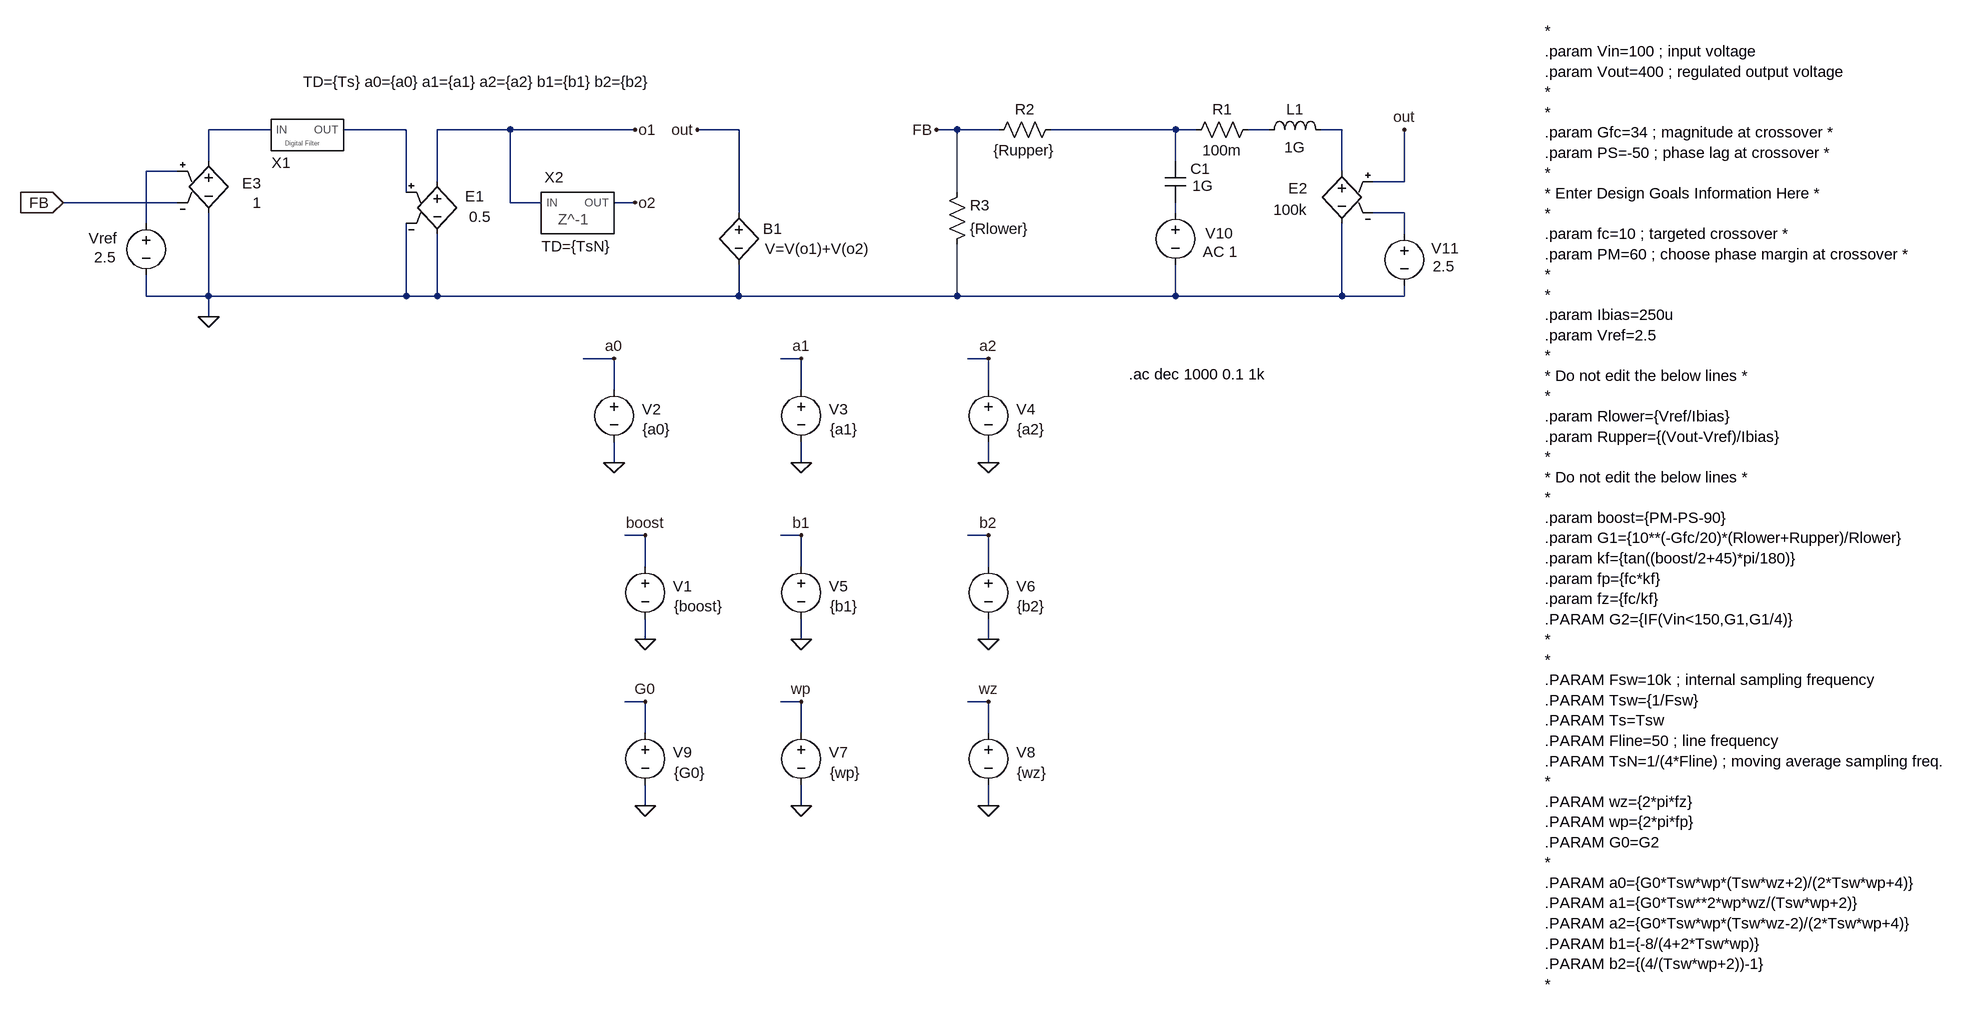
[diagram p0: schematic Type 2 digital notch -delay lines.asc]
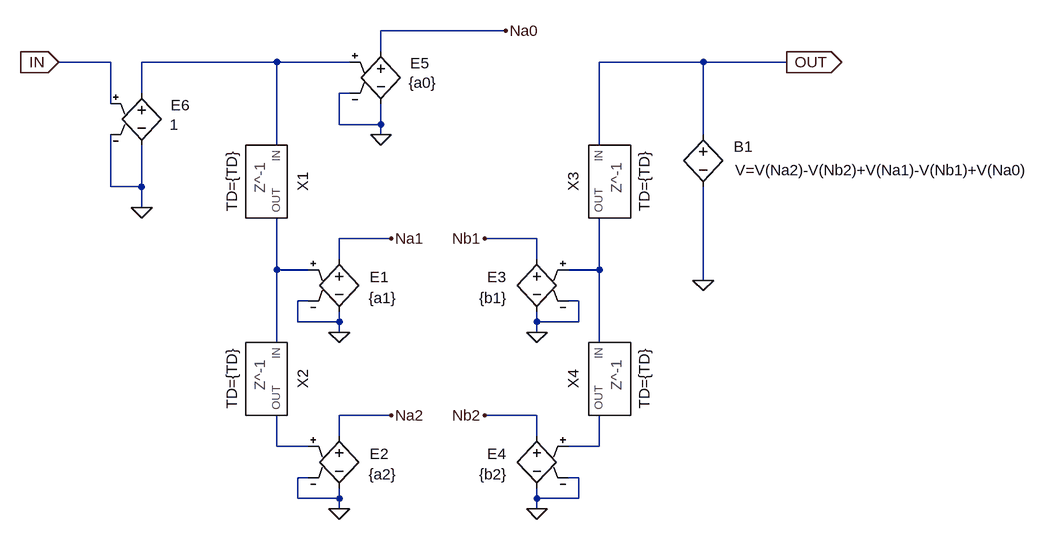
[diagram p1: sub-circuit type_2_digital.asc]
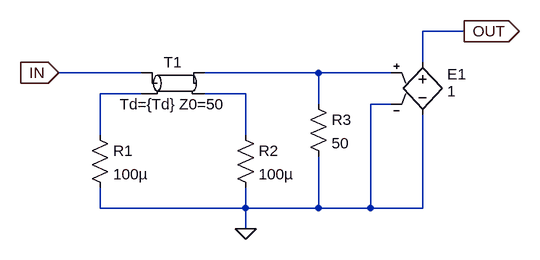
[diagram p2: sub-circuit zminus1.asc]
Type 2 digital notch -delay lines.asc, the LTspice schematic file:
Version 4
SHEET 1 1944 1524
WIRE -848 48 -944 48
WIRE -640 48 -736 48
WIRE -480 48 -592 48
WIRE -288 48 -480 48
WIRE -128 48 -192 48
WIRE 208 48 176 48
WIRE 272 48 208 48
WIRE 544 48 352 48
WIRE 576 48 544 48
WIRE 688 48 656 48
WIRE 800 48 768 48
WIRE -944 96 -944 48
WIRE 544 96 544 48
WIRE -992 112 -1040 112
WIRE 800 112 800 48
WIRE -592 128 -592 48
WIRE 896 128 896 48
WIRE 896 128 848 128
WIRE -640 144 -640 48
WIRE 208 144 208 48
WIRE -992 160 -1168 160
WIRE -480 160 -480 48
WIRE -432 160 -480 160
WIRE -288 160 -320 160
WIRE -128 176 -128 48
WIRE 544 176 544 160
WIRE 896 176 848 176
WIRE -1040 192 -1040 112
WIRE 896 208 896 176
WIRE -1040 304 -1040 272
WIRE -944 304 -944 176
WIRE -944 304 -1040 304
WIRE -640 304 -640 192
WIRE -640 304 -944 304
WIRE -592 304 -592 208
WIRE -592 304 -640 304
WIRE -128 304 -128 256
WIRE -128 304 -592 304
WIRE 208 304 208 224
WIRE 208 304 -128 304
WIRE 544 304 544 256
WIRE 544 304 208 304
WIRE 800 304 800 192
WIRE 800 304 544 304
WIRE 896 304 896 288
WIRE 896 304 800 304
WIRE -944 336 -944 304
WIRE -320 400 -368 400
WIRE -32 400 -64 400
WIRE 256 400 224 400
WIRE -320 448 -320 400
WIRE -32 448 -32 400
WIRE 256 448 256 400
WIRE -320 560 -320 528
WIRE -32 560 -32 528
WIRE 256 560 256 528
WIRE -272 672 -304 672
WIRE -32 672 -64 672
WIRE 256 672 224 672
WIRE -272 720 -272 672
WIRE -32 720 -32 672
WIRE 256 720 256 672
WIRE -272 832 -272 800
WIRE -32 832 -32 800
WIRE 256 832 256 800
WIRE -272 928 -304 928
WIRE -32 928 -64 928
WIRE 256 928 224 928
WIRE -272 976 -272 928
WIRE -32 976 -32 928
WIRE 256 976 256 928
WIRE -272 1088 -272 1056
WIRE -32 1088 -32 1056
WIRE 256 1088 256 1056
FLAG -944 336 0
FLAG -320 560 0
FLAG -32 560 0
FLAG -320 400 a0
FLAG -32 400 a1
FLAG 256 560 0
FLAG -32 832 0
FLAG 256 400 a2
FLAG -32 672 b1
FLAG 256 832 0
FLAG 256 672 b2
FLAG -32 1088 0
FLAG -32 928 wp
FLAG 256 1088 0
FLAG 256 928 wz
FLAG -272 1088 0
FLAG -272 928 G0
FLAG 896 48 out
FLAG 176 48 FB
FLAG -1168 160 FB
IOPIN -1168 160 In
FLAG -288 48 o1
FLAG -288 160 o2
FLAG -192 48 out
FLAG -272 832 0
FLAG -272 672 boost
DATAFLAG -368 400 ""
DATAFLAG -64 400 ""
DATAFLAG 224 400 ""
DATAFLAG -64 672 ""
DATAFLAG 224 672 ""
DATAFLAG -64 928 ""
DATAFLAG 224 928 ""
DATAFLAG -304 928 ""
DATAFLAG 464 48 ""
DATAFLAG -128 48 ""
DATAFLAG -304 672 ""
SYMBOL Type_2_digital -800 48 R0
WINDOW 39 275 -58 Bottom 2
WINDOW 0 -32 66 Bottom 2
SYMATTR SpiceLine TD={Ts} a0={a0} a1={a1} a2={a2} b1={b1} b2={b2}
SYMATTR InstName X1
SYMBOL voltage -320 432 R0
WINDOW 0 43 46 Left 2
WINDOW 3 44 77 Left 2
SYMATTR InstName V2
SYMATTR Value {a0}
SYMBOL voltage -32 432 R0
WINDOW 0 43 46 Left 2
WINDOW 3 44 77 Left 2
SYMATTR InstName V3
SYMATTR Value {a1}
SYMBOL voltage 256 432 R0
WINDOW 0 43 46 Left 2
WINDOW 3 44 77 Left 2
SYMATTR InstName V4
SYMATTR Value {a2}
SYMBOL voltage -32 704 R0
WINDOW 0 43 46 Left 2
WINDOW 3 44 77 Left 2
SYMATTR InstName V5
SYMATTR Value {b1}
SYMBOL voltage 256 704 R0
WINDOW 0 43 46 Left 2
WINDOW 3 44 77 Left 2
SYMATTR InstName V6
SYMATTR Value {b2}
SYMBOL voltage -32 960 R0
WINDOW 0 43 46 Left 2
WINDOW 3 44 77 Left 2
SYMATTR InstName V7
SYMATTR Value {wp}
SYMBOL voltage 256 960 R0
WINDOW 0 43 46 Left 2
WINDOW 3 44 77 Left 2
SYMATTR InstName V8
SYMATTR Value {wz}
SYMBOL voltage -272 960 R0
WINDOW 0 43 46 Left 2
WINDOW 3 44 77 Left 2
SYMATTR InstName V9
SYMATTR Value {G0}
SYMBOL e 800 96 M0
WINDOW 0 53 42 Left 2
WINDOW 3 53 75 Left 2
SYMATTR InstName E2
SYMATTR Value 100k
SYMBOL ind 672 64 R270
WINDOW 0 32 56 VTop 2
WINDOW 3 5 56 VBottom 2
SYMATTR InstName L1
SYMATTR Value 1G
SYMBOL res 672 32 R90
WINDOW 0 0 56 VBottom 2
WINDOW 3 32 56 VTop 2
SYMATTR InstName R1
SYMATTR Value 100m
SYMBOL cap 528 96 R0
WINDOW 0 39 12 Left 2
WINDOW 3 42 38 Left 2
SYMATTR InstName C1
SYMATTR Value 1G
SYMBOL voltage 544 160 R0
WINDOW 0 46 47 Left 2
WINDOW 123 42 76 Left 2
WINDOW 39 0 0 Left 0
SYMATTR InstName V10
SYMATTR Value2 AC 1
SYMATTR Value ""
SYMBOL voltage 896 192 R0
WINDOW 0 42 38 Left 2
WINDOW 3 44 66 Left 2
SYMATTR InstName V11
SYMATTR Value 2.5
SYMBOL res 368 32 R90
WINDOW 0 0 56 VBottom 2
WINDOW 3 32 56 VTop 2
SYMATTR InstName R2
SYMATTR Value {Rupper}
SYMBOL res 192 240 M180
WINDOW 0 36 76 Left 2
WINDOW 3 36 40 Left 2
SYMATTR InstName R3
SYMATTR Value {Rlower}
SYMBOL voltage -1040 176 M0
WINDOW 0 44 39 Left 2
WINDOW 3 46 68 Left 2
SYMATTR InstName Vref
SYMATTR Value 2.5
SYMBOL e -944 80 R0
WINDOW 0 52 50 Left 2
WINDOW 3 68 80 Left 2
SYMATTR InstName E3
SYMATTR Value 1
SYMBOL Zminus1 -384 160 R0
WINDOW 0 -28 -23 Bottom 2
WINDOW 39 6 83 Bottom 2
SYMATTR InstName X2
SYMATTR SpiceLine TD={TsN}
SYMBOL e -592 112 R0
WINDOW 0 43 38 Left 2
WINDOW 3 49 70 Left 2
SYMATTR InstName E1
SYMATTR Value 0.5
SYMBOL bv -128 160 R0
WINDOW 0 37 40 Left 2
WINDOW 3 40 71 Left 2
SYMATTR InstName B1
SYMATTR Value V=V(o1)+V(o2)
SYMBOL voltage -272 704 R0
WINDOW 0 43 46 Left 2
WINDOW 3 44 77 Left 2
SYMATTR InstName V1
SYMATTR Value {boost}
TEXT 1112 -104 Left 2 !*\n.param Vin=100 ; input voltage\n.param Vout=400 ; regulated output voltage\n*\n*\n.param Gfc=34 ; magnitude at crossover *\n.param PS=-50 ; phase lag at crossover *\n*\n* Enter Design Goals Information Here *\n*\n.param fc=10 ; targeted crossover *\n.param PM=60 ; choose phase margin at crossover *\n*\n*\n.param Ibias=250u\n.param Vref=2.5\n*\n* Do not edit the below lines *\n*\n.param Rlower={Vref/Ibias}\n.param Rupper={(Vout-Vref)/Ibias}\n*\n* Do not edit the below lines *\n*\n.param boost={PM-PS-90}\n.param G1={10**(-Gfc/20)*(Rlower+Rupper)/Rlower}\n.param kf={tan((boost/2+45)*pi/180)}\n.param fp={fc*kf}\n.param fz={fc/kf}\n.PARAM G2={IF(Vin<150,G1,G1/4)}\n*\n*\n.PARAM Fsw=10k ; internal sampling frequency\n.PARAM Tsw={1/Fsw}\n.PARAM Ts=Tsw\n.PARAM Fline=50 ; line frequency\n.PARAM TsN=1/(4*Fline) ; moving average sampling freq.\n*\n.PARAM wz={2*pi*fz}\n.PARAM wp={2*pi*fp}\n.PARAM G0=G2\n*\n.PARAM a0={G0*Tsw*wp*(Tsw*wz+2)/(2*Tsw*wp+4)}\n.PARAM a1={G0*Tsw**2*wp*wz/(Tsw*wp+2)}\n.PARAM a2={G0*Tsw*wp*(Tsw*wz-2)/(2*Tsw*wp+4)}\n.PARAM b1={-8/(4+2*Tsw*wp)}\n.PARAM b2={(4/(Tsw*wp+2))-1}\n*
TEXT 472 424 Left 2 !.ac dec 1000 0.1 1k

type_2_digital.asc, the sub-circuit schematic file:
Version 4
SHEET 1 1788 680
WIRE 544 -368 352 -368
WIRE 352 -336 352 -368
WIRE -64 -320 -144 -320
WIRE 192 -320 -16 -320
WIRE 304 -320 192 -320
WIRE 848 -320 688 -320
WIRE 976 -320 848 -320
WIRE -16 -272 -16 -320
WIRE 304 -272 288 -272
WIRE -64 -256 -64 -320
WIRE 288 -224 288 -272
WIRE 352 -224 352 -256
WIRE 352 -224 288 -224
WIRE 352 -208 352 -224
WIRE 848 -208 848 -320
WIRE 192 -192 192 -320
WIRE 688 -192 688 -320
WIRE -64 -128 -64 -208
WIRE -16 -128 -16 -192
WIRE -16 -128 -64 -128
WIRE -16 -96 -16 -128
WIRE 368 -48 288 -48
WIRE 592 -48 512 -48
WIRE 288 -16 288 -48
WIRE 592 -16 592 -48
WIRE 192 0 192 -80
WIRE 240 0 192 0
WIRE 688 0 688 -80
WIRE 688 0 640 0
WIRE 848 16 848 -128
WIRE 240 48 224 48
WIRE 656 48 640 48
WIRE 224 80 224 48
WIRE 288 80 288 64
WIRE 288 80 224 80
WIRE 592 80 592 64
WIRE 656 80 656 48
WIRE 656 80 592 80
WIRE 288 96 288 80
WIRE 592 96 592 80
WIRE 192 112 192 0
WIRE 688 112 688 0
WIRE 368 224 288 224
WIRE 592 224 512 224
WIRE 288 256 288 224
WIRE 592 256 592 224
WIRE 192 272 192 224
WIRE 240 272 192 272
WIRE 688 272 688 224
WIRE 688 272 640 272
WIRE 240 320 224 320
WIRE 656 320 640 320
WIRE 224 352 224 320
WIRE 288 352 288 336
WIRE 288 352 224 352
WIRE 592 352 592 336
WIRE 656 352 656 320
WIRE 656 352 592 352
WIRE 288 368 288 352
WIRE 592 368 592 352
FLAG 288 96 0
FLAG 288 368 0
FLAG 368 -48 Na1
FLAG 368 224 Na2
FLAG 592 96 0
FLAG 592 368 0
FLAG 512 -48 Nb1
FLAG 512 224 Nb2
FLAG 352 -208 0
FLAG 544 -368 Na0
FLAG 848 16 0
FLAG 976 -320 OUT
IOPIN 976 -320 Out
FLAG -144 -320 IN
IOPIN -144 -320 In
FLAG -16 -96 0
SYMBOL Zminus1 192 -144 R90
WINDOW 39 7 85 Bottom 2
SYMATTR SpiceLine TD={TD}
SYMATTR InstName X1
SYMBOL Zminus1 192 160 R90
WINDOW 39 7 85 Bottom 2
SYMATTR SpiceLine TD={TD}
SYMATTR InstName X2
SYMBOL e 288 -32 R0
WINDOW 0 47 43 Left 2
WINDOW 3 45 75 Left 2
SYMATTR InstName E1
SYMATTR Value {a1}
SYMBOL e 288 240 R0
WINDOW 0 47 43 Left 2
WINDOW 3 45 75 Left 2
SYMATTR InstName E2
SYMATTR Value {a2}
SYMBOL Zminus1 688 -144 M90
WINDOW 39 7 85 Bottom 2
SYMATTR SpiceLine TD={TD}
SYMATTR InstName X3
SYMBOL Zminus1 688 160 M90
WINDOW 39 7 85 Bottom 2
SYMATTR SpiceLine TD={TD}
SYMATTR InstName X4
SYMBOL e 592 -32 M0
WINDOW 0 47 43 Left 2
WINDOW 3 45 75 Left 2
SYMATTR InstName E3
SYMATTR Value {b1}
SYMBOL e 592 240 M0
WINDOW 0 47 43 Left 2
WINDOW 3 45 75 Left 2
SYMATTR InstName E4
SYMATTR Value {b2}
SYMBOL e 352 -352 R0
WINDOW 0 45 34 Left 2
WINDOW 3 43 64 Left 2
SYMATTR InstName E5
SYMATTR Value {a0}
SYMBOL bv 848 -224 R0
WINDOW 0 47 34 Left 2
WINDOW 3 49 70 Left 2
SYMATTR InstName B1
SYMATTR Value V=V(Na2)-V(Nb2)+V(Na1)-V(Nb1)+V(Na0)
SYMBOL e -16 -288 R0
WINDOW 0 45 34 Left 2
WINDOW 3 43 64 Left 2
SYMATTR InstName E6
SYMATTR Value 1

zminus1.asc, the sub-circuit schematic file:
Version 4
SHEET 1 880 680
WIRE 624 80 560 80
WIRE 560 128 560 80
WIRE 128 144 0 144
WIRE 400 144 224 144
WIRE 512 144 400 144
WIRE 128 176 64 176
WIRE 288 176 224 176
WIRE 400 192 400 144
WIRE 512 192 480 192
WIRE 64 240 64 176
WIRE 288 240 288 176
WIRE 64 352 64 320
WIRE 288 352 288 320
WIRE 288 352 64 352
WIRE 400 352 400 272
WIRE 400 352 288 352
WIRE 480 352 480 192
WIRE 480 352 400 352
WIRE 560 352 560 208
WIRE 560 352 480 352
WIRE 288 384 288 352
FLAG 624 80 OUT
IOPIN 624 80 Out
FLAG 0 144 IN
IOPIN 0 144 In
FLAG 288 384 0
SYMBOL tline 176 160 R0
SYMATTR InstName T1
SYMATTR Value Td={Td} Z0=50
SYMBOL res 48 224 R0
SYMATTR InstName R1
SYMATTR Value 100µ
SYMBOL res 272 224 R0
SYMATTR InstName R2
SYMATTR Value 100µ
SYMBOL res 384 176 R0
SYMATTR InstName R3
SYMATTR Value 50
SYMBOL e 560 112 R0
WINDOW 0 38 34 Left 2
WINDOW 3 38 60 Left 2
SYMATTR InstName E1
SYMATTR Value 1

The netlist it stands for:
* Type 2 digital notch -delay lines.asc
XX1 N001 N002 type_2_digital params: TD={Ts} a0={a0} a1={a1} a2={a2} b1={b1} b2={b2}
V2 a0 0 {a0}
V3 a1 0 {a1}
V4 a2 0 {a2}
V5 b1 0 {b1}
V6 b2 0 {b2}
V7 wp 0 {wp}
V8 wz 0 {wz}
V9 G0 0 {G0}
E2 N005 0 out N008 100k
L1 N004 N005 1G
R1 N004 N003 100m
C1 N003 N007 1G
V10 N007 0 AC 1
V11 N008 0 2.5
R2 N003 FB {Rupper}
R3 0 FB {Rlower}
Vref N006 0 2.5
E3 N001 0 N006 FB 1
XX2 o1 o2 zminus1 params: TD={TsN}
E1 o1 0 N002 0 0.5
B1 out 0 V=V(o1)+V(o2)
V1 boost 0 {boost}

* block symbol definitions
.subckt type_2_digital IN OUT
XX1 N001 N002 zminus1 params: TD={TD}
XX2 N002 N004 zminus1 params: TD={TD}
E1 Na1 0 N002 0 {a1}
E2 Na2 0 N004 0 {a2}
XX3 OUT N003 zminus1 params: TD={TD}
XX4 N003 N005 zminus1 params: TD={TD}
E3 Nb1 0 N003 0 {b1}
E4 Nb2 0 N005 0 {b2}
E5 Na0 0 N001 0 {a0}
B1 OUT 0 V=V(Na2)-V(Nb2)+V(Na1)-V(Nb1)+V(Na0)
E6 N001 0 IN 0 1
.ends type_2_digital

.subckt zminus1 IN OUT
T1 IN N002 N001 N003 Td={Td} Z0=50
R1 N002 0 100µ
R2 N003 0 100µ
R3 N001 0 50
E1 OUT 0 N001 0 1
.ends zminus1

*
.param Vin=100 ; input voltage
.param Vout=400 ; regulated output voltage
*
*
.param Gfc=34 ; magnitude at crossover *
.param PS=-50 ; phase lag at crossover *
*
* Enter Design Goals Information Here *
*
.param fc=10 ; targeted crossover *
.param PM=60 ; choose phase margin at crossover *
*
*
.param Ibias=250u
.param Vref=2.5
*
* Do not edit the below lines *
*
.param Rlower={Vref/Ibias}
.param Rupper={(Vout-Vref)/Ibias}
*
* Do not edit the below lines *
*
.param boost={PM-PS-90}
.param G1={10**(-Gfc/20)*(Rlower+Rupper)/Rlower}
.param kf={tan((boost/2+45)*pi/180)}
.param fp={fc*kf}
.param fz={fc/kf}
.PARAM G2={IF(Vin<150,G1,G1/4)}
*
*
.PARAM Fsw=10k ; internal sampling frequency
.PARAM Tsw={1/Fsw}
.PARAM Ts=Tsw
.PARAM Fline=50 ; line frequency
.PARAM TsN=1/(4*Fline) ; moving average sampling freq.
*
.PARAM wz={2*pi*fz}
.PARAM wp={2*pi*fp}
.PARAM G0=G2
*
.PARAM a0={G0*Tsw*wp*(Tsw*wz+2)/(2*Tsw*wp+4)}
.PARAM a1={G0*Tsw**2*wp*wz/(Tsw*wp+2)}
.PARAM a2={G0*Tsw*wp*(Tsw*wz-2)/(2*Tsw*wp+4)}
.PARAM b1={-8/(4+2*Tsw*wp)}
.PARAM b2={(4/(Tsw*wp+2))-1}
*
.ac dec 1000 0.1 1k
.backanno
.end